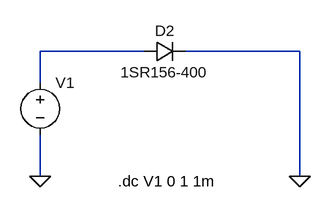
[diagram p0: schematic diodo-curva-caracteristica.asc]
diodo-curva-caracteristica.asc, the LTspice schematic file:
Version 4
SHEET 1 880 680
WIRE 176 64 16 64
WIRE 416 64 240 64
WIRE 16 112 16 64
WIRE 16 256 16 192
WIRE 416 256 416 64
FLAG 16 256 0
FLAG 416 256 0
SYMBOL diode 176 80 R270
WINDOW 0 32 32 VTop 2
WINDOW 3 0 32 VBottom 2
SYMATTR InstName D2
SYMATTR Value 1SR156-400
SYMBOL voltage 16 96 R0
WINDOW 123 0 0 Left 0
WINDOW 39 0 0 Left 0
SYMATTR InstName V1
SYMATTR Value ""
TEXT 136 264 Left 2 !.dc V1 0 1 1m

The netlist it stands for:
* diodo-curva-caracteristica.asc
D2 N001 0 1SR156-400
V1 N001 0
.model D D
.lib standard.dio
.dc V1 0 1 1m
.backanno
.end